# EAGLE design achizitie (EAGLE 6.6.0)
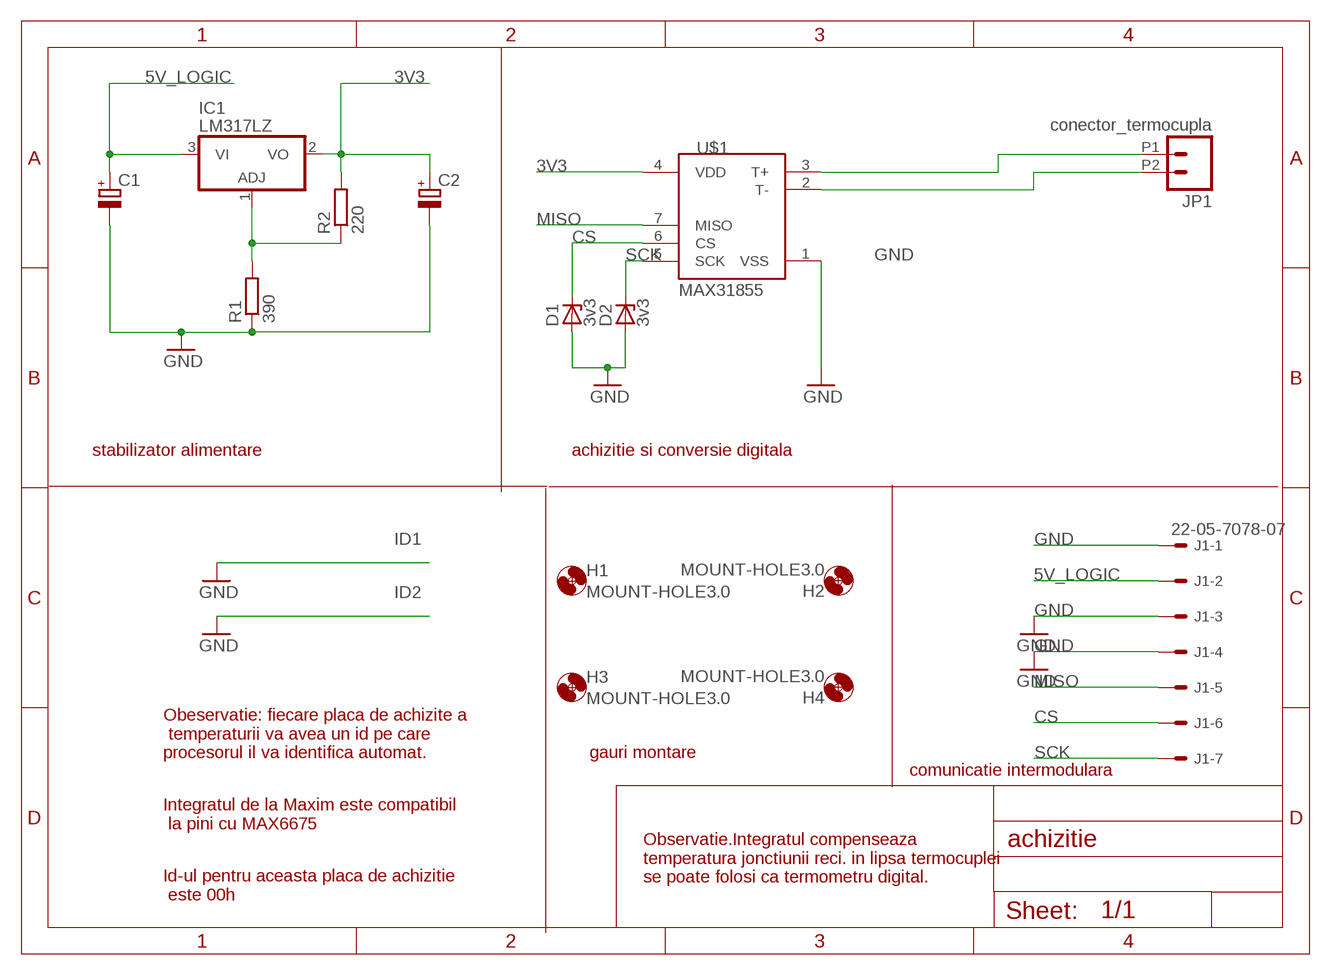
[diagram p0: schematic, sheet 1]

## Parts
C1  CPOL-EUE2,5-6E  [E2,5-6E]
C2  CPOL-EUE2,5-6E  [E2,5-6E]
D1  3v3  ZENER-DIODESOD80C  [SOD80C]
D2  3v3  ZENER-DIODESOD80C  [SOD80C]
H1  MOUNT-HOLE3.0  [3,0]
H2  MOUNT-HOLE3.0  [3,0]
H3  MOUNT-HOLE3.0  [3,0]
H4  MOUNT-HOLE3.0  [3,0]
IC1  LM317LZ  [TO92]
J1  22-05-7078-07  [7395-07]
JP1  conector_termocupla  M022.54MM_SCREWTERM  [1X02_2.54_SCREWTERM]
R1  390  R-EU_M1206  [M1206]
R2  220  R-EU_M1206  [M1206]
U$1  MAX31855  MAX6675  [SO08-MAX6675]

## Nets
3V3: C2.+ IC1.2(VO) R2.2 U$1.4(VDD)
5V_LOGIC: C1.+ IC1.3(VI) J1.2
CS: D1.C J1.6 U$1.6(CS)
GND: C1.- C2.- D1.A D2.A J1.1 J1.3 J1.4 R1.1 U$1.1(VSS)
MISO: J1.5 U$1.7(MISO)
N$3: IC1.1(ADJ) R1.2 R2.1
N$7: JP1.P1 U$1.3(T+)
N$8: JP1.P2 U$1.2(T-)
SCK: D2.C J1.7 U$1.5(SCK)

## Notes on the sheet
- stabilizator alimentare | achizitie si conversie digitala
- Obeservatie: fiecare placa de achizite a
   temperaturii va avea un id pe care 
  procesorul il va identifica automat.
- gauri montare
- comunicatie intermodulara
- Integratul de la Maxim este compatibil
   la pini cu MAX6675
- Observatie.Integratul compenseaza 
  temperatura jonctiunii reci. in lipsa termocuplei
  se poate folosi ca termometru digital.
- Id-ul pentru aceasta placa de achizitie
   este 00h

## Library data of the parts
C1 C2 = resistor:CPOL-EU: POLARIZED CAPACITOR, European symbol
D1 D2 = diode:ZENER-DIODE: Z-Diode
H1-H4 = holes:MOUNT-HOLE: MOUNTING HOLE with drill center marker
IC1 = linear:*317: Positive VOLTAGE REGULATOR
J1 = con-molex:22-?-07: CONNECTOR wire to board 2.54 mm (.1 inch) pitch header; OC_FARNELL: unknown; OC_NEWARK: unknown
JP1 = SparkFun-Connectors:M02: Standard 2-pin 0.1" header. Use with - straight break away headers ( PRT-00116) - right angle break away headers (PRT-00553) - swiss pins (PRT-00743) - machine pins (PRT-00117) - female headers (PRT-00115) Molex polarized connector foot print use with: PRT-08233 with associated crimp pins and housings. 2.54_SCREWTERM for use with PRT-10571. 3.5mm Screw Terminal footprints for PRT-08084 5mm Screw Terminal footprints for use with PRT-08433
R1 R2 = resistor:R-EU_: RESISTOR, European symbol
U$1 = SparkFun-AnalogIC:MAX6675: K-type thermocouple ADC, SPI output

## Board
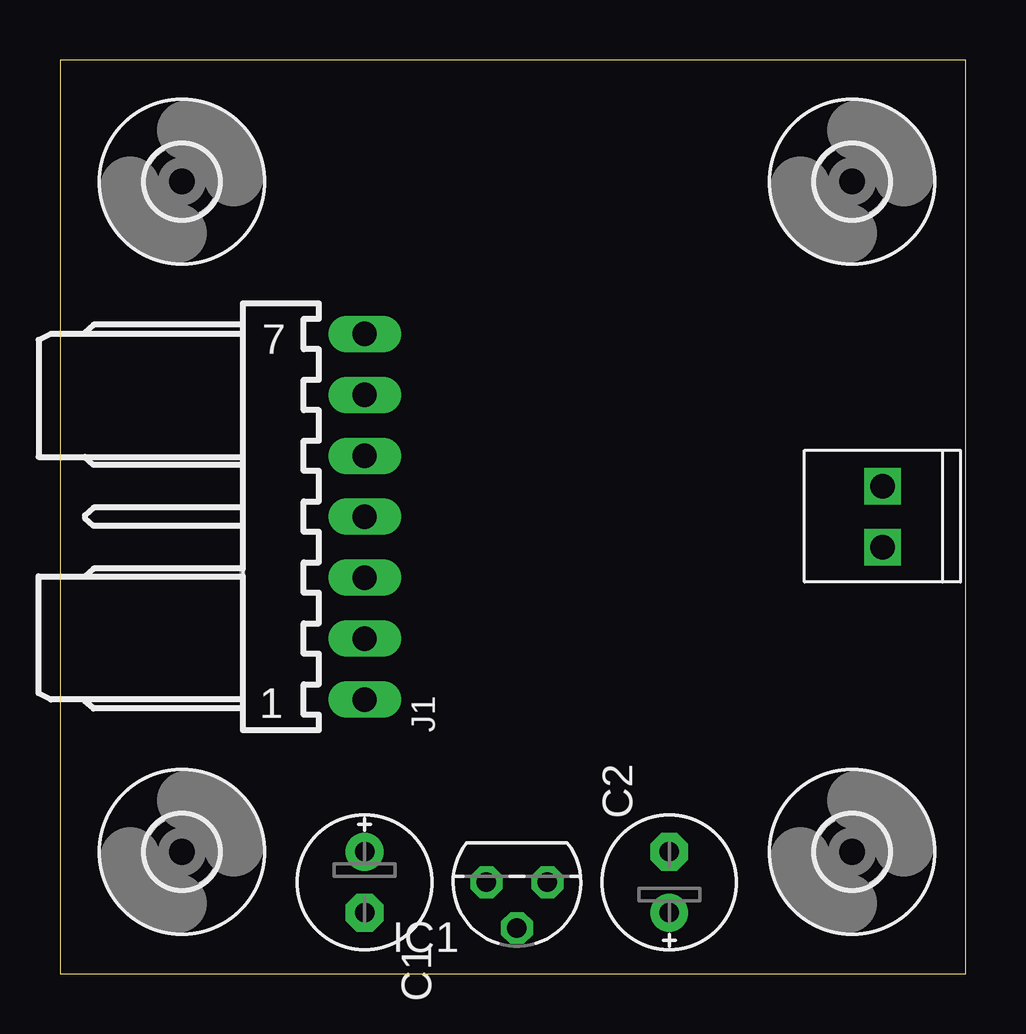
[diagram p1: board, top side]
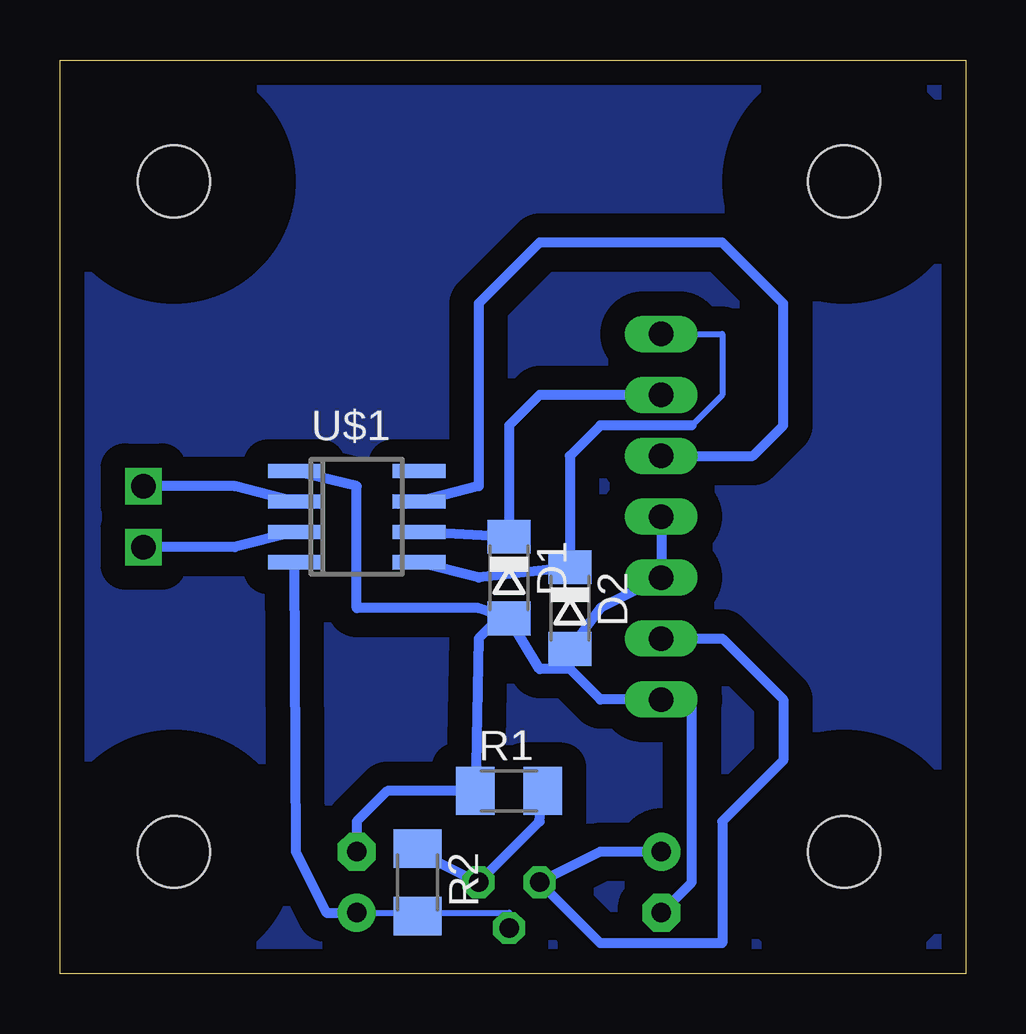
[diagram p2: board, bottom side, seen from below]

Size 37.77 x 38.09 mm. Coordinates in mm from the lower left corner, seen from the top.
Outline: 0,0 37.77,0 37.77,38.09 0,38.09 0,0
Copper layers (1*16): Top 0.035mm / dielectric 1.5mm / Bottom 0.035mm
Design rules "default": minimum track width 10mil, minimum drill 24mil, track to track 8mil, track to pad 8mil, pad to pad 8mil, via to via 8mil, smd to smd 8mil, copper to edge 40mil, drill to drill 8mil, minimum pad ring 10mil, minimum via ring 8mil, stop-mask expansion 4mil, vias tented up to drill 0mil, thermal gap 10mil

### Footprints (pad centres in the part's own frame; a part is rotated, then mirrored left to right if it is on the bottom)
E2,5-6E = drill 0.813 pad 1.575: + -1.27,0 | drill 0.813 pad 1.575 octagon: - 1.27,0
SOD80C = smd 1.4 x 1.8: A 1.7,0; C -1.7,0
3,0 = hole 3: 0,0
TO92 = drill 0.813 octagon: 1 -1.27,0; 2 0,1.905; 3 1.27,0
7395-07 = drill 1.016 long: 1 7.62,0; 2 5.08,0; 3 2.54,0; 4 0,0; 5 -2.54,0; 6 -5.08,0; 7 -7.62,0
1X02_2.54_SCREWTERM = drill 1.016 square: P1 2.54,0; P2 0,0
M1206 = smd 1.6 x 2: 1 -1.4,0; 2 1.4,0
SO08-MAX6675 = smd 0.6 x 2.2: 1 -1.905,-2.6; 2 -0.635,-2.6; 3 0.635,-2.6; 4 1.905,-2.6; 5 1.905,2.6; 6 0.635,2.6; 7 -0.635,2.6; 8 -1.905,2.6

### Placement (x,y rotation side)
C1  12.7,3.81 270 top
C2  25.4,3.81 90 top
D1  19.05,16.51 270 bottom
D2  16.51,15.24 270 bottom
H1  5.08,33.02 0 top
H2  33.02,33.02 0 top
H3  33.02,5.08 0 top
H4  5.08,5.08 0 top
IC1  19.05,3.81 180 top
J1  12.7,19.05 270 top
JP1  34.29,20.32 270 top
R1  19.05,7.62 0 bottom
R2  22.86,3.81 270 bottom
U$1  25.4,19.05 270 bottom

### Tracks (layer width: path | path; a pad name or v marks a point on that pad's centre or on a via)
3V3
  Bottom 0.254: C2.+ 22.86,2.54 | 22.86,2.54 19.05,2.54 IC1.2 | 22.86,2.54 R2.2
  Bottom 0.406: U$1.4 27.94,5.08 26.67,2.54 C2.+
5V_LOGIC
  Bottom 0.406: J1.2 10.16,13.97 7.62,11.43 7.62,8.89 10.16,6.35 10.16,1.27 15.24,1.27 IC1.3 15.24,5.08 C1.+
CS
  Bottom 0.254: 19.05,17.78 D1.C
  Bottom 0.406: U$1.6 D1.C 19.05,22.86 17.78,24.13 J1.6
GND
  Bottom 0.254: 19.05,15.24 D1.A | 16.51,13.97 D2.A | J1.1 11.43,11.43 | 20.32,7.62 R1.1
  Bottom 0.406: U$1.1 25.4,20.32 25.4,15.24 20.32,15.24 D1.A 17.78,12.7 16.51,12.7 | J1.1 15.24,11.43 16.51,12.7 | 16.51,12.7 D2.A 15.24,15.24 J1.3 J1.4 | 19.05,15.24 20.32,13.97 R1.1 24.13,7.62 25.4,6.35 C2.- | C1.- 11.43,3.81 11.43,11.43
MISO
  Bottom 0.406: J1.5 8.89,21.59 7.62,22.86 7.62,27.94 10.16,30.48 17.78,30.48 20.32,27.94 20.32,20.32 U$1.7
N$1
  pour Bottom (isolate 1.016): 0,38.1 38.1,38.1 38.1,0 0,0
N$3
  Bottom 0.254: 22.86,5.08 R2.1 | 17.78,7.62 R1.2
  Bottom 0.406: 22.86,5.08 IC1.1 17.78,6.35 R1.2
N$7
  Bottom 0.406: U$1.3 30.48,17.78 JP1.P1
N$8
  Bottom 0.406: U$1.2 30.48,20.32 JP1.P2
SCK
  Bottom 0.254: 11.43,22.86 10.16,24.13 10.16,26.67 J1.7 | 16.51,16.51 D2.C
  Bottom 0.406: U$1.5 20.32,16.51 D2.C 16.51,21.59 15.24,22.86 11.43,22.86